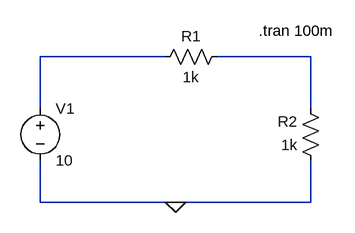
[diagram p0: schematic assignment 2 ltspice.asc]
assignment 2 ltspice.asc, the LTspice schematic file:
Version 4.1
SHEET 1 880 680
WIRE 304 -80 112 -80
WIRE 528 -80 384 -80
WIRE 112 0 112 -80
WIRE 528 0 528 -80
WIRE 112 144 112 80
WIRE 320 144 112 144
WIRE 528 144 528 80
WIRE 528 144 320 144
FLAG 320 144 0
SYMBOL voltage 112 -16 R0
SYMATTR InstName V1
SYMATTR Value 10
SYMBOL res 400 -96 R90
WINDOW 0 0 56 VBottom 2
WINDOW 3 32 56 VTop 2
SYMATTR InstName R1
SYMATTR Value 1k
SYMBOL res 544 96 R180
WINDOW 0 36 76 Left 2
WINDOW 3 36 40 Left 2
SYMATTR InstName R2
SYMATTR Value 1k
TEXT 448 -120 Left 2 !.tran 100m

The netlist it stands for:
* assignment 2 ltspice.asc
V1 N001 0 10
R1 N002 N001 1k
R2 0 N002 1k
.tran 100m
.backanno
.end